# EasyEDA Pro project Wifi-controller.eprj

# Schematic Schematic1
Board Name: Board1; Create Date: 2025-03-18; Page Name: P1; Project Name: Wifi-controller; Schematic Name: Schematic1; Update Date: 2025-03-19; Company: 嘉立创EDA; Page Size: A4; Version: V1.0
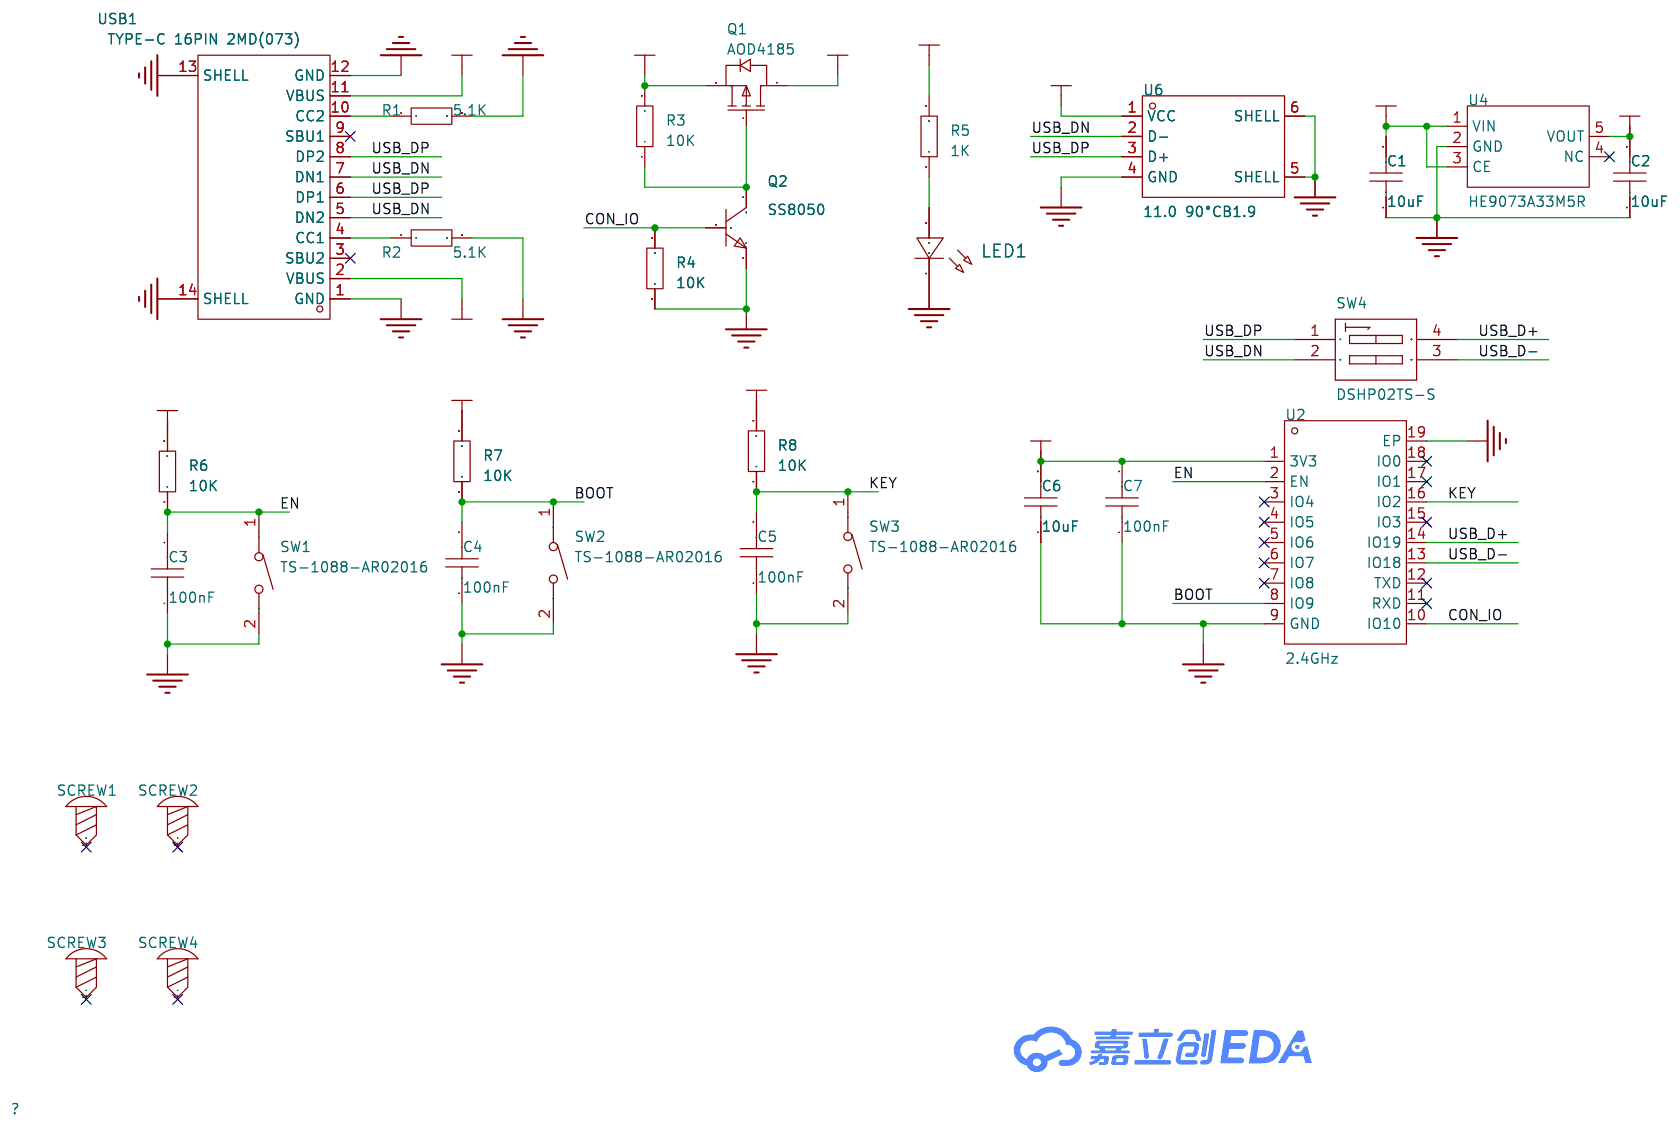
[diagram p0: schematic sheet]

## Parts
C1  10uF  [C0805]
C2  10uF  [C0805]
C3  100nF  [C0805]
C4  100nF  [C0805]
C5  100nF  [C0805]
C6  10uF  [C0805]
C7  100nF  [C0805]
LED1  -  [LED_0603]
Q1  AOD4185  [TO-252-3_L6.6-W6.1-P4.57-LS9.9-BR-CW]
Q2  SS8050  [SOT-23-3_L2.9-W1.3-P1.90-LS2.4-BR]
R1  5.1K  [R0805]
R2  5.1K  [R0805]
R3  10K  [R0805]
R4  10K  [R0805]
R5  1K  [R0805]
R6  10K  [R0805]
R7  10K  [R0805]
R8  10K  [R0805]
SCREW1  -  [M3螺丝]
SCREW2  -  [M3螺丝]
SCREW3  -  [M3螺丝]
SCREW4  -  [M3螺丝]
SW1  TS-1088-AR02016  [SW-SMD_L3.9-W3.0-P4.45]
SW2  TS-1088-AR02016  [SW-SMD_L3.9-W3.0-P4.45]
SW3  TS-1088-AR02016  [SW-SMD_L3.9-W3.0-P4.45]
SW4  DSHP02TS-S  [SW-SMD_DSHP02TS-S_1]
U2  2.4GHz  [BULETM-SMD_ESPRESSIF_ESP32-C3-WROOM-02-N4-4MB]
U4  HE9073A33M5R  [SOT-23-5_L3.0-W1.7-P0.95-LS2.8-BL]
U6  11.0 90°CB1.9  [USB-A-TH_905-761A2022D10201]
USB1  TYPE-C 16PIN 2MD(073)  [USB-C-SMD_TYPE-C-6PIN-2MD-073]

## Library data of the parts
C1-C7 = CAP_0603: Supplier Footprint: 0603
LED1 = LED_0603-R: Supplier Footprint: 0603
Q1 = AOD4185_C400894: LCSC Part Name: 1个P沟道 耐压:40V 电流:40A; Supplier Part: C400894; Manufacturer: AOS; Supplier Footprint: TO-252(DPAK); JLCPCB Part Class: Extended Part; Datasheet: https://atta.szlcsc.com/upload/public/pdf/source/20190627/C400894_921958B6CB7B7C674397E60AAED89785.pdf; Supplier: LCSC; Type: 1个P沟道; Drain Source Voltage (Vdss): 40V; Continuous Drain Current (Id): 40A; Drain Source On Resistance (RDS(on)@Vgs,Id): 20mΩ@4.5V,15A; Power Dissipation (Pd): 62.5W; Gate Threshold Voltage (Vgs(th)@Id): 1.7V@250uA; Total Gate Charge (Qg@Vgs): 42nC@10V; Input Capacitance (Ciss@Vds): 2.55nF@20V; Reverse Transfer Capacitance (Crss@Vds): 190pF@20V; Operating Temperature: -55℃~+175℃
Q2 = SS8050_C7420370: LCSC Part Name: H档 200-350; Supplier Part: C7420370; Manufacturer: 宏嘉诚; Supplier Footprint: SOT-23; JLCPCB Part Class: 扩展库; Datasheet: https://atta.szlcsc.com/upload/public/pdf/source/20250205/5DB94E86981B5B1A1866D18E379C0D4F.pdf; Supplier: LCSC; type: NPN; Current - Collector(Ic): 1.5A; Collector - Emitter Voltage VCEO: 25V; Pd - Power Dissipation: 300mW; DC Current Gain: 120@100mA,1.0V; Transition frequency(fT): 100MHz; Current - Collector Cutoff: 100nA; Vce Saturation(VCE(sat)): 500mV; Operating Temperature: -55℃~+150℃
R1-R8 = Res_0603: Supplier Footprint: 0603
SCREW1-SCREW4 = M3螺丝: Supplier Footprint: 插件
SW1-SW3 = TS-1088-AR02016: LCSC Part Name: 4*3*2mm 立贴 轻触开关; Supplier Part: C720477; Manufacturer: XUNPU(讯普); Supplier Footprint: SMD; JLCPCB Part Class: Extended Part; Datasheet: https://atta.szlcsc.com/upload/public/pdf/source/20200810/C720475_60D09DD6C54279ADDB2DC25100F1CC11.pdf; Supplier: LCSC; Circuit: 单刀单掷; Actuator Style: 圆形按钮; Operating Force: 160gf; Mounting Style: 立贴; Switch Length: 4mm; Switch Width: 3mm; Switch Height: 2mm; Strike Gundam: 不带; Contact Current: 50mA; Voltage Rating (DC): 12V; Insulation Resistance: 100MΩ; Actuator/Cap Color: 黑色; Pin Style: SMD接片; Mechanical Life: 10万次; Operating Temperature: -30℃~+80℃
SW4 = DSHP02TS-S: LCSC Part Name: 间距1.27mm 平拨,凹槽式 2位拨码开关; Supplier Part: C319052; Manufacturer: XKB Connectivity(中国星坤); Supplier Footprint: SMD-4P,4.1x5.4mm; JLCPCB Part Class: Extended Part; Datasheet: https://atta.szlcsc.com/upload/public/pdf/source/20211009/11BE85C99D2C85B0991AF4F9D6EB8BDE.pdf; Supplier: LCSC; Type: 平拨,凹槽式; Circuit: 单刀单掷; Number of Positions: 2位; Pin Style: 鸥翼型; Lead Pitch: 1.27mm; Current Rating: 25mA; Voltage Rating: 24V; Operating Temperature: -20℃~+70℃; Operating Life: 3千次; Color: 黑色
U2 = ESP32-C3-WROOM-02-N4: Supplier Part: C2934560; Manufacturer: ESPRESSIF(乐鑫); Supplier Footprint: VFQFN-32-EP; JLCPCB Part Class: Extended Part; Datasheet: https://atta.szlcsc.com/upload/public/pdf/source/20220106/F07459EFFE1D7CBA94B4FB8A075146A6.pdf; Supplier: LCSC; Core Processor: ESP32-C3芯片; Support Interface: I2C；GPIO；SPI；JTAG；UART；USB；I2S; Output Power: 20.5dBm
U4 = HE9073A33M5R: LCSC Part Name: 输入7V 输出3.3V 500mA; Supplier Part: C723789; Manufacturer: HEERMICR(赫尔半导体); Supplier Footprint: SOT-23-5; JLCPCB Part Class: 扩展库; Datasheet: https://atta.szlcsc.com/upload/public/pdf/source/20200818/C723783_47C0FB0690B3745218579CD1DF0C296C.pdf; Supplier: LCSC; Output Type: 固定; Voltage - Supply: 7V; Output Voltage: 3.3V; Output Current: 500mA; Power Supply Rejection Ratio (PSRR): 70dB@(1kHz); Voltage Dropout: 100mV; standby current: 300nA; Features: 短路保护；低ESR；热保护(TSD)；过流保护(OCP)；带使能; Output Configuration: 正极; Number of Outputs: 1
U6 = 11.0 90°CB1.9: LCSC Part Name: Type-A 母 沉板; Supplier Part: C6386902; Manufacturer: SHOU HAN(首韩); Supplier Footprint: 插件; JLCPCB Part Class: 扩展库; Datasheet: https://atta.szlcsc.com/upload/public/pdf/source/20230609/8CE5F59DF77F3C710154EDED7A87DFE0.pdf; Supplier: LCSC; Connector Type: Type-A; Standard: USB 2.0; Gender: 母; Mounting Style: 沉板; Number of Contacts: 4P; Number of Ports: 1; Current Rating - Power (Max): 1.5A; Rated Voltage (Max): 30V; Connect-Disconnect Life: 5千次; Length: 11mm; Core Colour: 黑色; Operating Temperature Range: -25℃~+85℃
USB1 = TYPE-C 16PIN 2MD(073): LCSC Part Name: Type-C 母 卧贴; Supplier Part: C2765186; Manufacturer: SHOU HAN(首韩); Supplier Footprint: SMD; JLCPCB Part Class: 扩展库; Datasheet: https://atta.szlcsc.com/upload/public/pdf/source/20211123/39B17C16241EAC15C5E277BDA434118E.pdf; Supplier: LCSC; Connector Type: Type-C; Standard: USB 3.1; Gender: 母; Mounting Style: 卧贴; Number of Contacts: 16P; Number of Ports: 1; Current Rating - Power (Max): 5A; Operating Temperature Range: -25℃~+85℃; Rated Voltage (Max): 5V; Connect-Disconnect Life: 5千次; Core Colour: 黑色

## Nets
+3.3V: C2.2 C6.2 C7.2 R6.2 R7.2 R8.2 U2.1(3V3) U4.5(VOUT)
GND: C1.1 C2.1 C3.1 C4.1 C5.1 C6.1 C7.1 LED1.1(C) Q2.2(E) R1.2 R2.2 R4.1 SW1.2 SW2.2 SW3.2 U2.9(GND) U2.19(EP) U4.2(GND) U6.4(GND) U6.5(SHELL) U6.6(SHELL) USB1.1(GND) USB1.12(GND) USB1.13(SHELL) USB1.14(SHELL)
VIN: C1.2 Q1.3(S) R3.2 U4.1(VIN) U4.3(CE) USB1.2(VBUS) USB1.11(VBUS)
BOOT: C4.2 R7.1 SW2.1 U2.8(IO9)
CON_IO: Q2.1(B) R4.2 U2.10(IO10)
EN: C3.2 R6.1 SW1.1 U2.2(EN)
KEY: C5.2 R8.1 SW3.1 U2.16(IO2)
USB_D+: SW4.4(B1) U2.14(IO19)
USB_D-: SW4.3(B2) U2.13(IO18)
USB_DN: SW4.2(A2) U6.2(D-) USB1.5(DN2) USB1.7(DN1)
USB_DP: SW4.1(A1) U6.3(D+) USB1.6(DP1) USB1.8(DP2)
VOUT: Q1.2(D) R5.2 U6.1(VCC)
$1N1452: R1.1 USB1.10(CC2)
$1N1463: R2.1 USB1.4(CC1)
$1N1595: Q1.1(G) Q2.3(C) R3.1
$1N1805: LED1.2(A) R5.1

Not connected (* = marked no-connect by the designer): SCREW1 1*; SCREW2 1*; SCREW3 1*; SCREW4 1*; U2 3(IO4)* 4(IO5)* 5(IO6)* 6(IO7)* 7(IO8)* 11(RXD)* 12(TXD)* 15(IO3)* 17(IO1)* 18(IO0)*; U4 4(NC)*; USB1 3(SBU2)* 9(SBU1)*

# Board PCB1
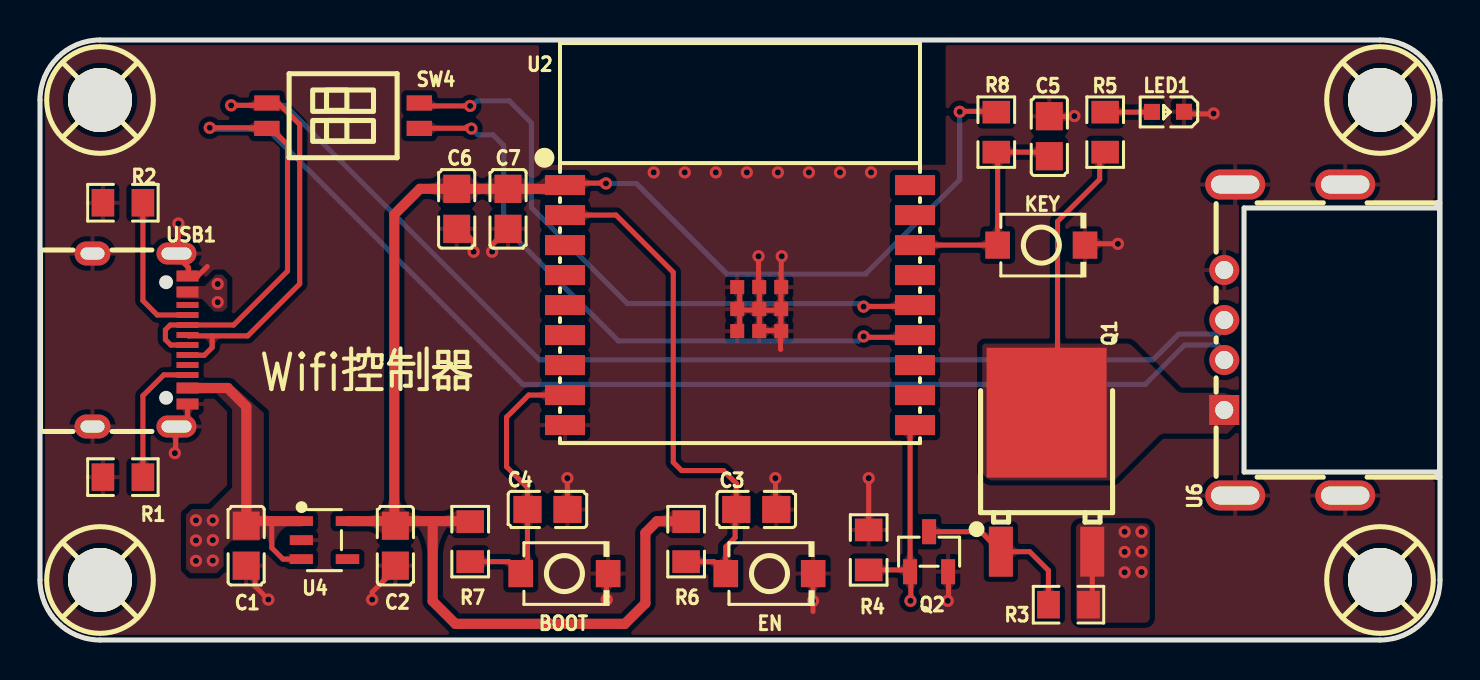
[diagram p1: board, top side]
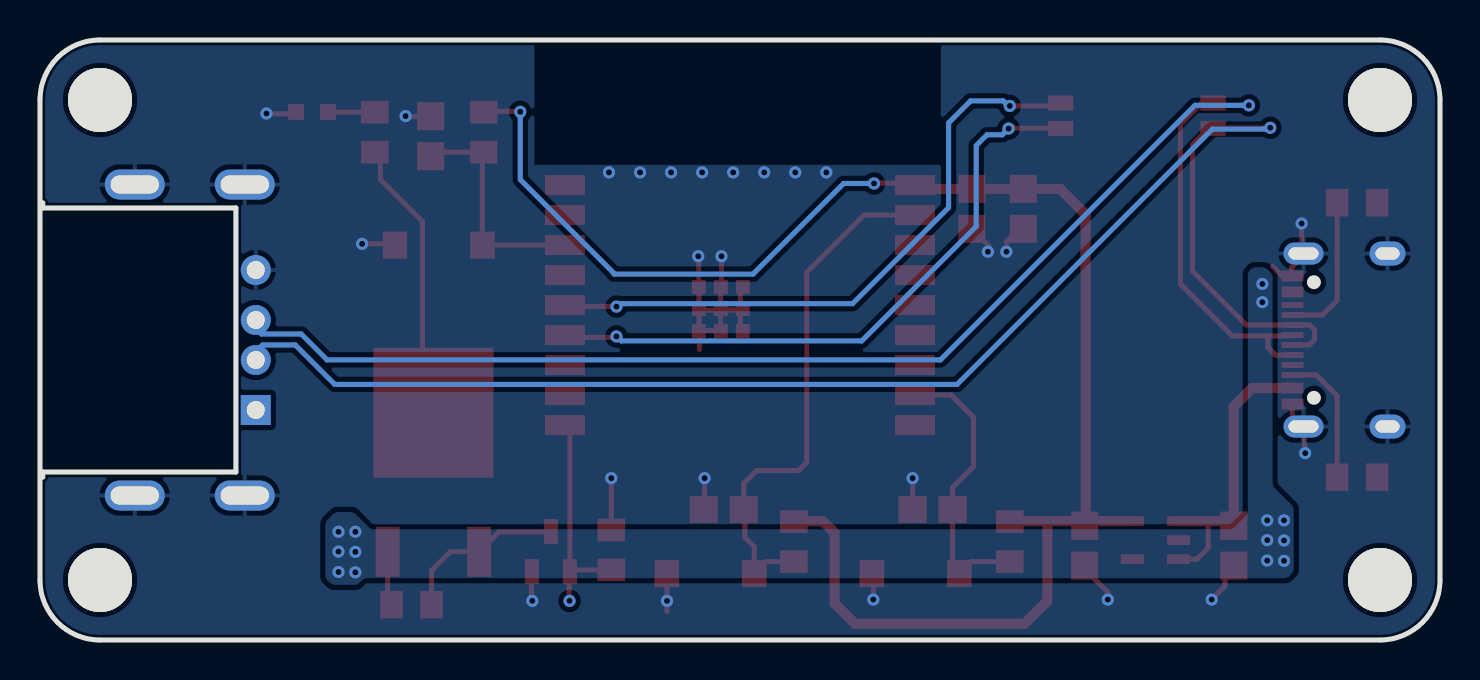
[diagram p2: board, bottom side, seen from below]

Outline 70 x 30 mm; copper layers: Top Layer, Bottom Layer. Coordinates in mm from the lower left corner of the outline.
Outline path: 0,27 0,3 arc(0.88,0.88) 3,0 67,0 arc(69.12,0.88) 70,3 70,27 arc(69.12,29.12) 67,30 3,30 arc(0.88,29.12) 0,27
Stack: Top Layer 0.035mm / Dielectric1 1.51mm FR4 er 4.5 / Bottom Layer 0.035mm

## Design rules (mm)
template: 自定义配置
spacing copperThickness1oz (default): track to track 0.102, other pairs 0.152 to 0.3
spacing copperThickness2oz: track to track 0.203, other pairs 0.152 to 0.3
spacing typeA: track to track 0.152, other pairs 0 to 0.3
track width copperThickness1oz (default): min 0.127, default 0.254, max 2.54
track width copperThickness2oz: min 0.203, default 0.254, max 2.54
differential pair differentialPair (default): width min 0.127, default 0.254, max 2.54; gap min 0.152, default 0.152
via viaSize (default): diameter min 0.5, default 0.61, max 10; hole min 0.3, default 0.305, max 6.3
region e1563 uses typeA

## Placement (name value [footprint] x y rotation side)
BOOT  TS-1088-AR02016  [SW-SMD_L3.9-W3.0-P4.45]  26.22 3.32 0 top
C1  10uF  [C0805]  10.31 4.72 90 top
C2  10uF  [C0805]  17.77 4.72 90 top
C3  100nF  [C0805]  35.81 6.53 180 top
C4  100nF  [C0805]  25.37 6.53 180 top
C5  100nF  [C0805]  50.47 25.19 270 top
C6  10uF  [C0805]  20.83 21.56 90 top
C7  100nF  [C0805]  23.4 21.56 90 top
EN  TS-1088-AR02016  [SW-SMD_L3.9-W3.0-P4.45]  36.47 3.32 0 top
KEY  TS-1088-AR02016  [SW-SMD_L3.9-W3.0-P4.45]  50.07 19.74 0 top
LED1  -  [LED_0603]  56.35 26.4 180 top
Q1  AOD4185  [TO-252-3_L6.6-W6.1-P4.57-LS9.9-BR-CW]  50.33 7.89 270 top
Q2  SS8050  [SOT-23-3_L2.9-W1.3-P1.90-LS2.4-BR]  44.45 4.42 270 top
R1  5.1K  [R0805]  4.15 8.14 180 top
R2  5.1K  [R0805]  4.15 21.86 180 top
R3  10K  [R0805]  51.43 1.77 0 top
R4  10K  [R0805]  41.43 4.5 270 top
R5  1K  [R0805]  53.26 25.39 270 top
R6  10K  [R0805]  32.31 4.92 90 top
R7  10K  [R0805]  21.51 4.92 90 top
R8  10K  [R0805]  47.81 25.39 90 top
SCREW1  -  [M3螺丝]  3 3 0 top
SCREW2  -  [M3螺丝]  3 27 0 top
SCREW3  -  [M3螺丝]  67 3 0 top
SCREW4  -  [M3螺丝]  67 27 0 top
SW4  DSHP02TS-S  [SW-SMD_DSHP02TS-S_1]  15.16 26.21 270 top
U2  2.4GHz  [BULETM-SMD_ESPRESSIF_ESP32-C3-WROOM-02-N4-4MB]  35 16.75 0 top
U4  HE9073A33M5R  [SOT-23-5_L3.0-W1.7-P0.95-LS2.8-BL]  14.22 4.99 270 top
U6  11.0 90°CB1.9  [USB-A-TH_905-761A2022D10201]  62.24 15 90 top
USB1  TYPE-C 16PIN 2MD(073)  [USB-C-SMD_TYPE-C-6PIN-2MD-073]  5 15 270 top

## Footprints (pads in the part's own frame, mm; a bottom-side part is the same pattern mirrored in y, then rotated)
BULETM-SMD_ESPRESSIF_ESP32-C3-WROOM-02-N4-4MB
  rect 2x1 smd: 1(-8.75,6) 2(-8.75,4.5) 3(-8.75,3) 4(-8.75,1.5) 5(-8.75,0) 6(-8.75,-1.5) 7(-8.75,-3) 8(-8.75,-4.5) 9(-8.75,-6) 10(8.75,-6) 11(8.75,-4.5) 12(8.75,-3) 13(8.75,-1.5) 14(8.75,0) 15(8.75,1.5) 16(8.75,3) 17(8.75,4.5) 18(8.75,6)
  rect 0.7x0.7 smd: 19(-0.14,0.9) 19(-0.14,-0.2) 19(-0.14,-1.3) 19(0.96,0.9) 19(0.96,-0.2) 19(0.96,-1.3) 19(2.06,0.9) 19(2.06,-0.2) 19(2.06,-1.3)
C0805
  rect 1.41x1.35 smd: 1(-1,0) 2(1,0)
LED_0603
  rect 0.8x0.8 smd: 1(-0.851,-0.01) 2(0.75,-0.005)
M3螺丝
  round 3.2 hole 3.2: 1(0,0)
R0805
  rect 1.133x1.377 smd: 1(-1,0) 2(1,0)
SOT-23-3_L2.9-W1.3-P1.90-LS2.4-BR
  rect 1.25x0.7 smd: 1(1,-0.95) 2(1,0.95) 3(-1,0)
SOT-23-5_L3.0-W1.7-P0.95-LS2.8-BL
  rect 0.49x1.157 smd: 1(-0.95,-1.153) 2(0,-1.153) 3(0.95,-1.153)
  rect 0.49x1.175 smd: 4(0.95,1.153) 5(-0.95,1.153)
SW-SMD_DSHP02TS-S_1
  rect 0.76x1.27 smd: 1(-0.635,-3.81) 2(0.635,-3.81) 3(0.635,3.81) 4(-0.635,3.81)
SW-SMD_L3.9-W3.0-P4.45
  rect 1.23x1.36 smd: 1(-2.185,0) 2(2.185,0)
TO-252-3_L6.6-W6.1-P4.57-LS9.9-BR-CW
  rect 2.5x1.2 smd: 1(3.475,-2.286) 3(3.475,2.286)
  rect 6.5x6 smd: 2(-3.475,0)
USB-A-TH_905-761A2022D10201
  rect 1.5x1.5 hole 0.9: 1(-3.5,3.025)
  round 1.5 hole 0.9: 2(-1,3.025) 3(1,3.025) 4(3.5,3.025)
  oval 1.5x3 hole 0.9x2.415: 5(-7.775,2.475) 5(-7.775,-3.025) 6(7.775,2.475) 6(7.775,-3.025)
USB-C-SMD_TYPE-C-6PIN-2MD-073
  rect 0.55x1.1 smd: 1(-3.2,2.375) 2(-2.4,2.375) 11(2.4,2.375) 12(3.2,2.375)
  rect 0.3x1.1 smd: 3(-1.75,2.375) 4(-1.25,2.375) 5(-0.75,2.375) 6(-0.25,2.375) 7(0.25,2.375) 8(0.75,2.375) 9(1.25,2.375) 10(1.75,2.375)
  oval 1.1x2 hole 0.6x1.5: 13(-4.325,1.825) 14(4.325,1.825)
  oval 1.2x1.8 hole 0.6x1.2: 13(-4.325,-2.375) 14(4.325,-2.375)

## Nets
+3.3V: C2.2 C6.2 C7.2 R6.2 R7.2 R8.2 U2.1 U4.5
GND: BOOT.2 C1.1 C2.1 C3.1 C4.1 C5.1 C6.1 C7.1 EN.2 KEY.2 LED1.1 Q2.2 R1.2 R2.2 R4.1 U2.9 U2.19 U4.2 U6.4 U6.5 U6.6 USB1.1 USB1.12 USB1.13 USB1.14
VIN: C1.2 Q1.3 R3.2 U4.1 U4.3 USB1.2 USB1.11
BOOT: BOOT.1 C4.2 R7.1 U2.8
CON_IO: Q2.1 R4.2 U2.10
EN: C3.2 EN.1 R6.1 U2.2
KEY: C5.2 KEY.1 R8.1 U2.16
USB_D+: SW4.4 U2.14
USB_D-: SW4.3 U2.13
USB_DN: SW4.2 U6.2 USB1.5 USB1.7
USB_DP: SW4.1 U6.3 USB1.6 USB1.8
VOUT: Q1.2 R5.2 U6.1
$1N1452: R1.1 USB1.10
$1N1463: R2.1 USB1.4
$1N1595: Q1.1 Q2.3 R3.1
$1N1805: LED1.2 R5.1

Pads without a net: SCREW1 1; SCREW2 1; SCREW3 1; SCREW4 1; U2 3 4 5 6 7 11 12 15 17 18; U4 4; USB1 3 9

## Via types
v1: diameter 0.61, hole 0.305, Top Layer to Bottom Layer, 48 vias

## Routing (per net, layer and track width the routed paths; a pad name or vN(x,y) marks a point on that pad's centre or on a via; arc(x,y) is an arc through that point)
+3.3V: length 80
  Top Layer w0.254: 27.05,22.96 27.17,22.84 28.08,22.84 28.08,22.9 ; 47.75,26.43 46.01,26.43 v1(45.99,26.41)
  Top Layer w0.508: 17.72,5.94 19.63,5.94 ; 17.72,5.94 U4.5 ; 17.72,5.94 17.72,5.77 C2.2 ; 17.72,5.94 17.72,21.28 18.99,22.56 C6.2 C7.2 26.06,22.56 U2.1 ; 19.63,5.94 21.48,5.94 R7.2 ; 19.63,5.94 19.63,1.95 20.77,0.81 29.24,0.81 30.27,1.83 30.27,5.36 30.85,5.94 32.29,5.94 R6.2
  Bottom Layer w0.254: 41.31,18.29 34.35,18.29 29.81,22.83 v1(28.3,22.83) ; 41.28,18.32 45.99,23.02 v1(45.99,26.41)
GND: length 37.2
  Top Layer w0.254: 21.13,20.47 21.67,19.93 21.67,19.47 ; v1(58.68,26.33) 58.66,26.31 57.16,26.31 ; 35.97,15.37 35.97,15.47 ; 35.97,15.47 35.97,16.49 ; 35.97,15.47 36.91,15.47 ; 7.14,10.71 7.38,10.94 7.38,11.71 ; 7.63,18.18 7.87,18.18 8.36,18.67 ; 10.76,3.22 10.76,2.68 v1(11.42,2.02) ; 35.97,16.49 35.97,17.54 ; 35.97,16.49 37,16.49 37.05,16.53 ; 35.97,16.49 35.89,16.49 35.88,16.5 34.98,16.5 ; 26.37,6.78 26.37,8.01 ; 37.06,17.67 37.06,19.11 37.09,19.14 ; 37.05,17.41 37.05,16.53 ; 37.05,16.53 37.1,16.59 ; 37.05,16.53 37.05,15.42 37.07,15.39 ; 7.42,18.25 7.42,18.62 6.87,19.18 ; 45.43,3.27 45.43,1.91 45.39,1.87 ; 22.57,19.52 22.57,19.72 23.13,20.29 ; 34.85,15.59 34.98,15.72 34.98,16.5 ; 28.32,3.12 28.32,1.97 28.34,1.96 ; 34.98,17.47 34.98,16.5 ; 34.98,16.5 34.89,16.5 ; 52.59,19.81 53.89,19.81 v1(53.9,19.81) ; v1(6.74,9.34) 6.78,9.38 6.78,10.47 ; 37.04,14.53 37.03,14.55 37.03,15.41 ; v1(36.77,8.09) 36.78,8.09 36.78,6.78 ; 17.68,3.47 16.61,2.4 v1(16.61,2.02) ; 50.73,26.17 51.69,26.17 v1(51.72,26.2) ; 38.62,2.99 38.65,2.96 v1(38.65,1.96) 38.65,1.42 ; 35.93,17.7 v1(35.93,19.19) ; 41.44,5.82 41.44,7.84 ; 6.92,19.34 v1(6.92,20.83)
  vias: v1(21.68,19.41) v1(22.61,19.41) v1(26.37,8.09) v1(28.34,2.02) v1(30.68,23.38) v1(32.24,23.38) v1(33.79,23.38) v1(35.34,23.38) v1(36.89,23.38) v1(37.09,19.19) v1(38.45,23.38) v1(40,23.38) v1(41.44,8.09) v1(41.55,23.38) v1(45.39,1.96)
VIN: length 17.9
  Top Layer w0.254: 11.59,5.94 11.59,4.6 12.15,4.04 13.07,4.04 ; R3.2 52.62,1.95 Q1.3
  Top Layer w0.508: 10.32,5.73 10.54,5.94 U4.1 ; 10.32,5.73 10.32,11.67 9.38,12.6 USB1.11 ; 10.32,5.73 C1.2
  vias: v1(7.8,5.98) v1(7.8,4.98) v1(7.8,3.96) v1(8.64,5.98) v1(8.64,4.99) v1(8.64,3.97) v1(8.88,17.8) v1(8.88,16.89) v1(54.23,5.41) v1(54.23,4.41) v1(54.23,3.38) v1(55.08,5.41) v1(55.08,4.42) v1(55.08,3.4)
BOOT: length 14.5
  Top Layer w0.254: U2.8 24.43,12.25 23.33,11.14 23.33,8.66 24.37,7.62 C4.2 24.37,3.66 BOOT.1 23.44,3.92 R7.1
CON_IO: length 10.9
  Top Layer w0.254: 43.52,1.89 43.54,1.91 43.54,3.2 ; U2.10 43.5,10.5 Q2.1 43.42,3.5 R4.2
  vias: v1(43.52,1.96)
EN: length 26.6
  Top Layer w0.254: R6.1 33.69,3.92 EN.1 34.29,4.66 34.76,5.12 34.76,6.47 C3.2 34.81,7.83 34.17,8.47 32.08,8.47 31.66,8.89 31.66,18.38 28.8,21.25 U2.2
KEY: length 11.5
  Top Layer w0.254: C5.2 50.26,24.39 R8.1 47.88,24.32 KEY.1 ; U2.16 47.88,19.75
USB_D+: length 31.4
  Top Layer w0.254: 19.13,27.07 19.5,26.7 v1(21.51,26.7) ; 41.21,16.68 43.65,16.68 43.71,16.62
  Bottom Layer w0.254: 21.62,26.73 21.84,26.96 23.47,26.96 24.57,25.86 24.57,21.62 29.37,16.82 41.03,16.82 v1(41.18,16.67)
USB_D-: length 31
  Top Layer w0.254: 43.35,15.13 41.22,15.13 v1(41.18,15.18) ; 19.07,25.59 21.28,25.59 21.36,25.68
  Bottom Layer w0.254: 41.17,15.19 40.93,14.95 28.91,14.95 23.19,20.68 23.19,24.72 22.65,25.26 21.88,25.26 v1(21.57,25.57)
USB_DN: length 76.9
  Top Layer w0.254: USB1.7 6.54,14.75 6.27,15.02 6.27,15.51 6.51,15.75 USB1.5 9.68,15.75 12.38,18.45 12.38,24.77 11.56,25.58 SW4.2 ; 11.16,25.61 v1(8.49,25.61)
  Bottom Layer w0.254: 8.45,25.54 11.38,25.54 24.14,12.78 55.26,12.78 57.23,14.75 58.87,14.75 59.18,14.45 59.18,13.92
USB_DP: length 76.1
  Top Layer w0.254: 8.61,15.2 10.38,15.2 12.98,17.81 12.98,25.77 11.91,26.85 SW4.1 ; 8.61,15.2 8.61,14.63 8.21,14.23 7.39,14.23 USB1.8 ; 8.61,15.2 7.42,15.2 USB1.6 ; v1(9.56,26.73) 10.76,26.73 10.86,26.84
  Bottom Layer w0.254: v1(9.56,26.73) 12.25,26.73 24.98,14.01 55.65,14.01 56.94,15.3 58.93,15.3 58.93,16.18
VOUT: length 12.4
  Top Layer w0.254: 51.14,12.96 50.88,13.23 50.88,20.92 52.98,23.03 52.98,24.4
$1N1452: length 6.7
  Top Layer w0.254: USB1.10 7.37,13.26 6.19,13.26 5.15,12.21 R1.1
$1N1463: length 7.4
  Top Layer w0.254: USB1.4 5.86,16.25 5.15,16.97 R2.1
$1N1595: length 8.5
  Top Layer w0.254: R3.1 50.42,1.77 50.42,3.48 49.48,4.42 Q1.1 47.04,5.41 44.45,5.41
$1N1805: length 2.3
  Top Layer w0.254: R5.1 55.59,26.39 LED1.2

## Copper pours and planes (outline as drawn; the poured copper is in the pictures)
GND on Top Layer: -4.46,32.35 79.32,32.35 79.32,-7.44 -4.46,-7.44
GND on Bottom Layer: -4.46,35.81 74.86,35.81 74.86,-3.58 -4.46,-3.58
VIN on Top Layer: 6.95,12.81 11.19,12.81 11.19,3.34 6.95,3.34
VIN on Top Layer: 6.88,18.27 9.36,18.27 9.36,16.42 6.88,16.42
VIN on Top Layer: 51.8,5.84 55.49,5.84 55.49,0.86 51.8,0.86
VIN on Bottom Layer: 7.32,18.64 55.73,18.64 55.73,2.76 7.32,2.76
VOUT on Top Layer: 47.11,14.82 59.74,14.82 59.74,7.98 47.11,7.98

Small or netless copper shapes (teardrops, artwork), in the pictures only: 131 on Top Layer, 10 on Bottom Layer

## Text on the board
Top Silkscreen Layer: Wifi控制器
